# EAGLE schematic v2 (EAGLE 9.6.2)
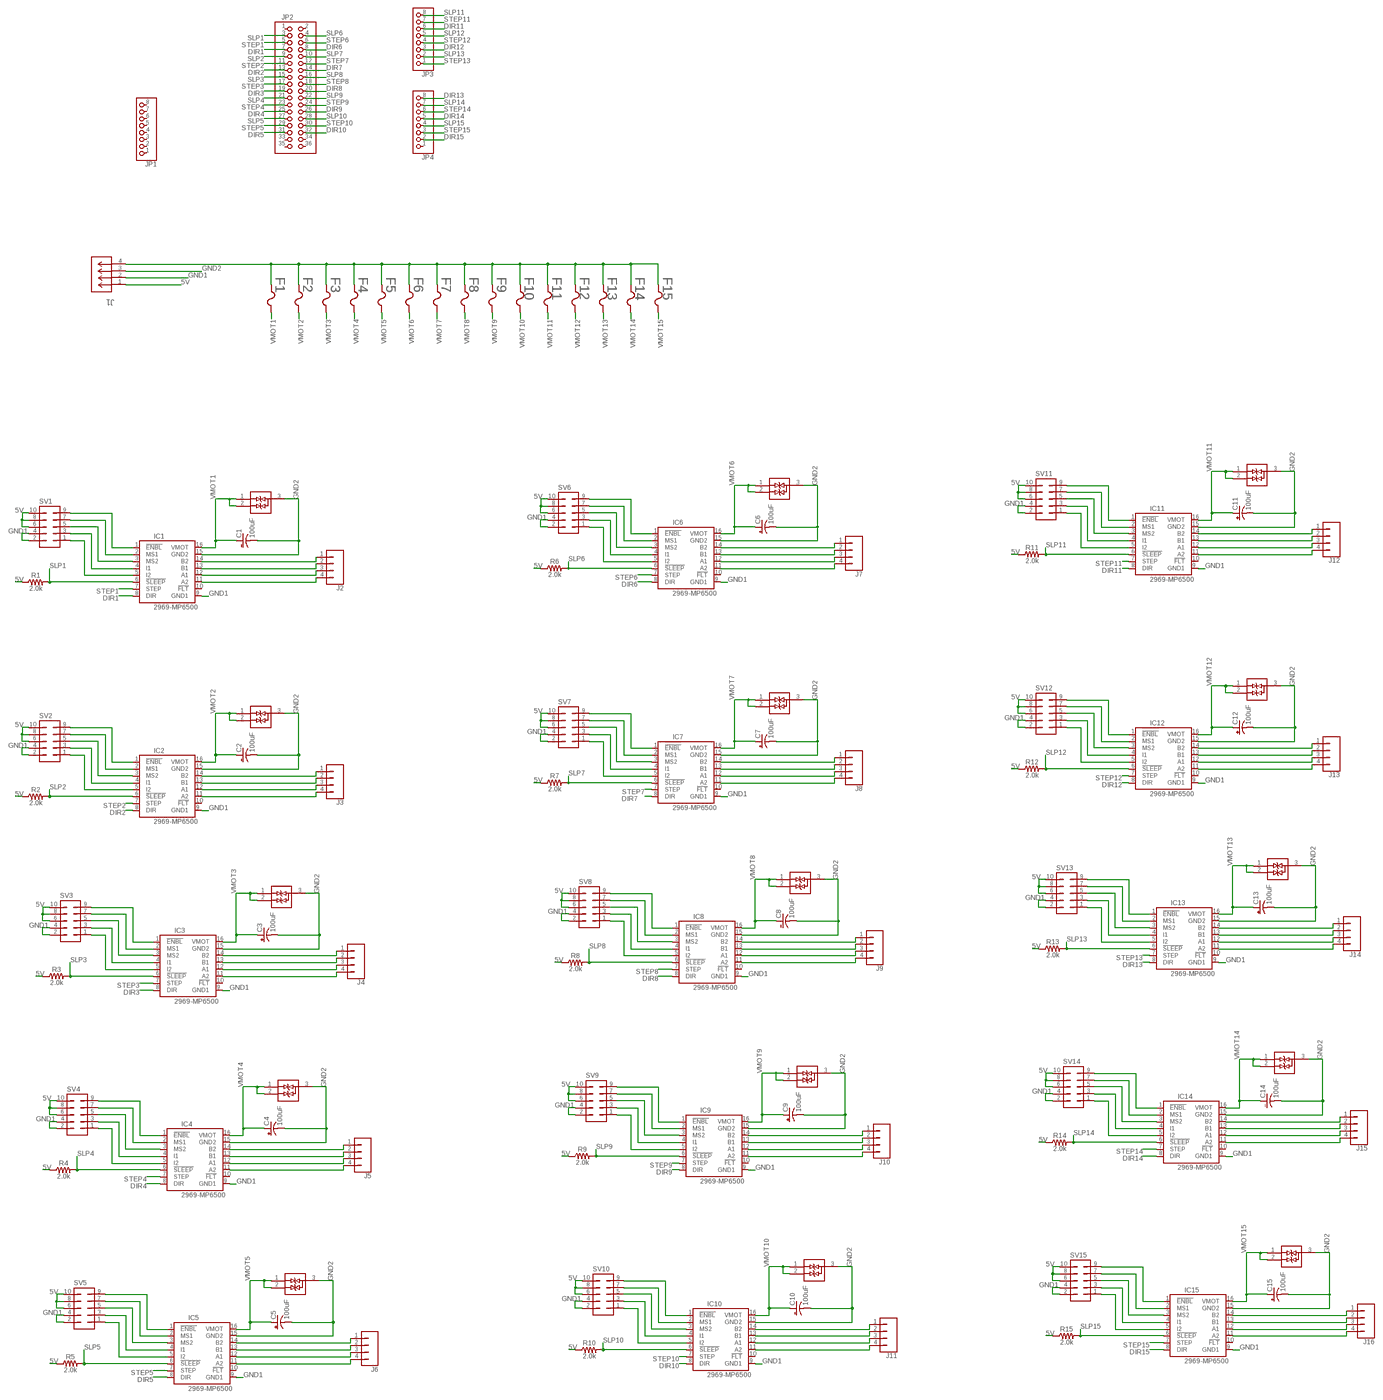
[diagram p0: schematic, sheet 1, overview]
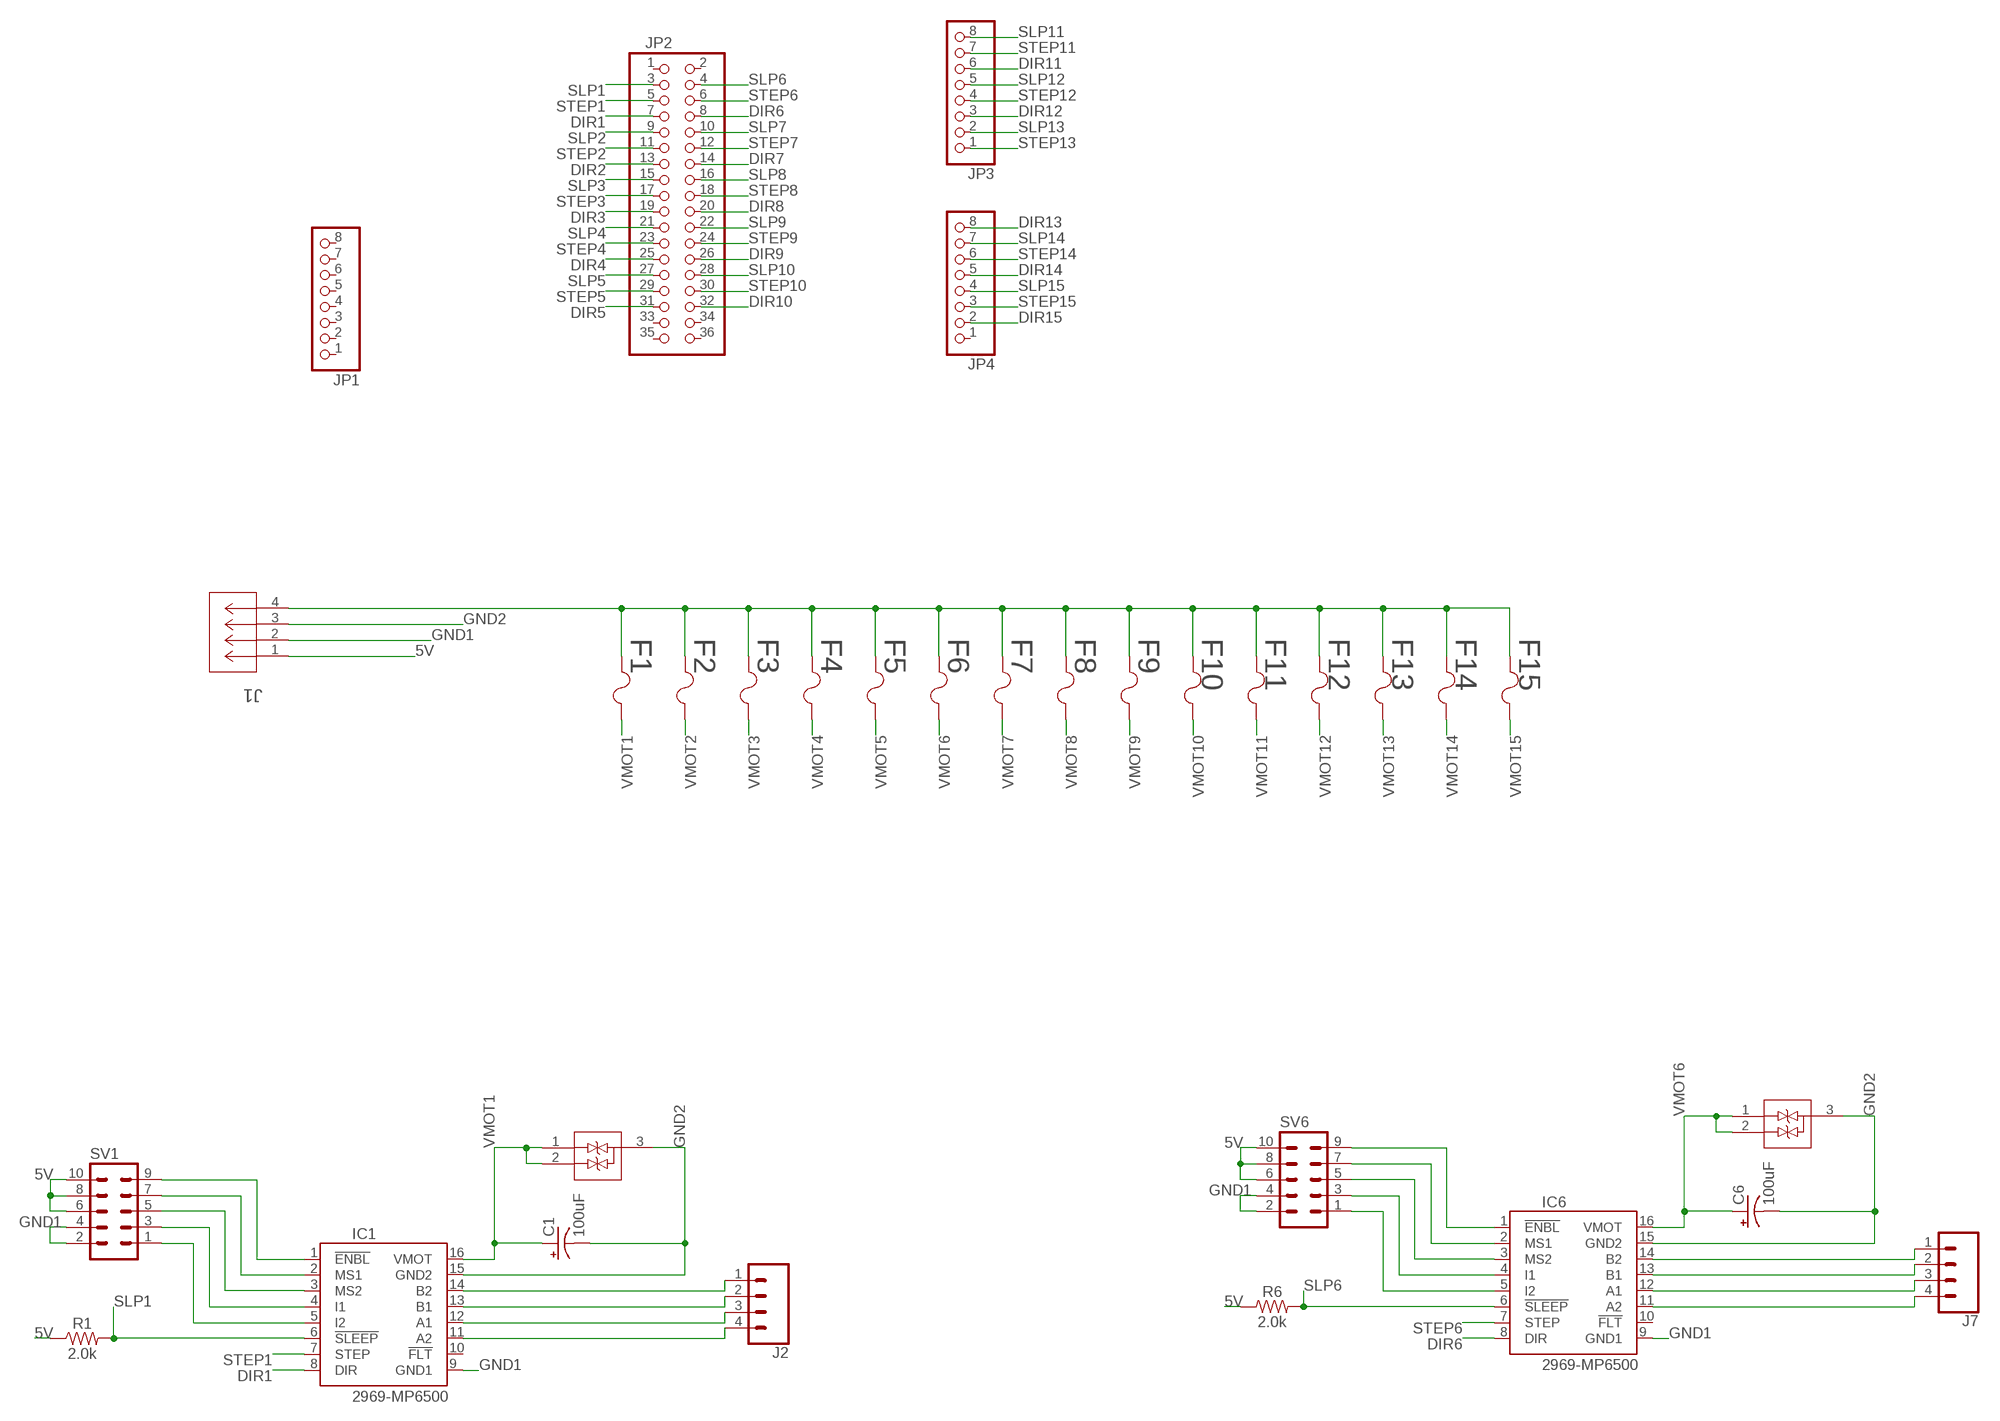
[diagram p1: schematic, sheet 1, part 1 of 4]
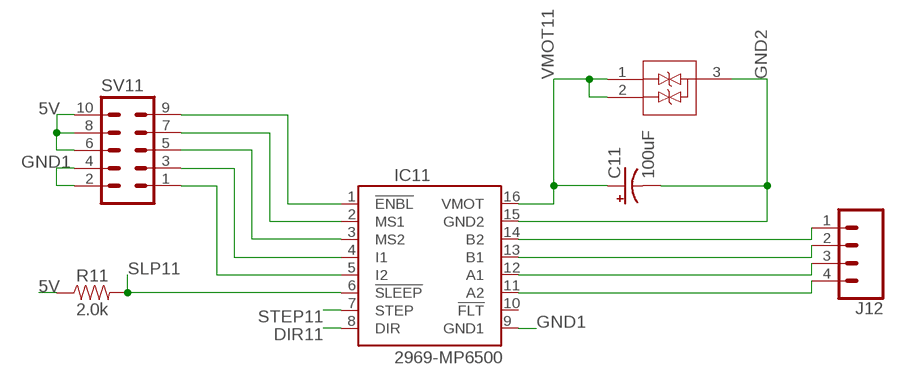
[diagram p2: schematic, sheet 1, part 2 of 4]
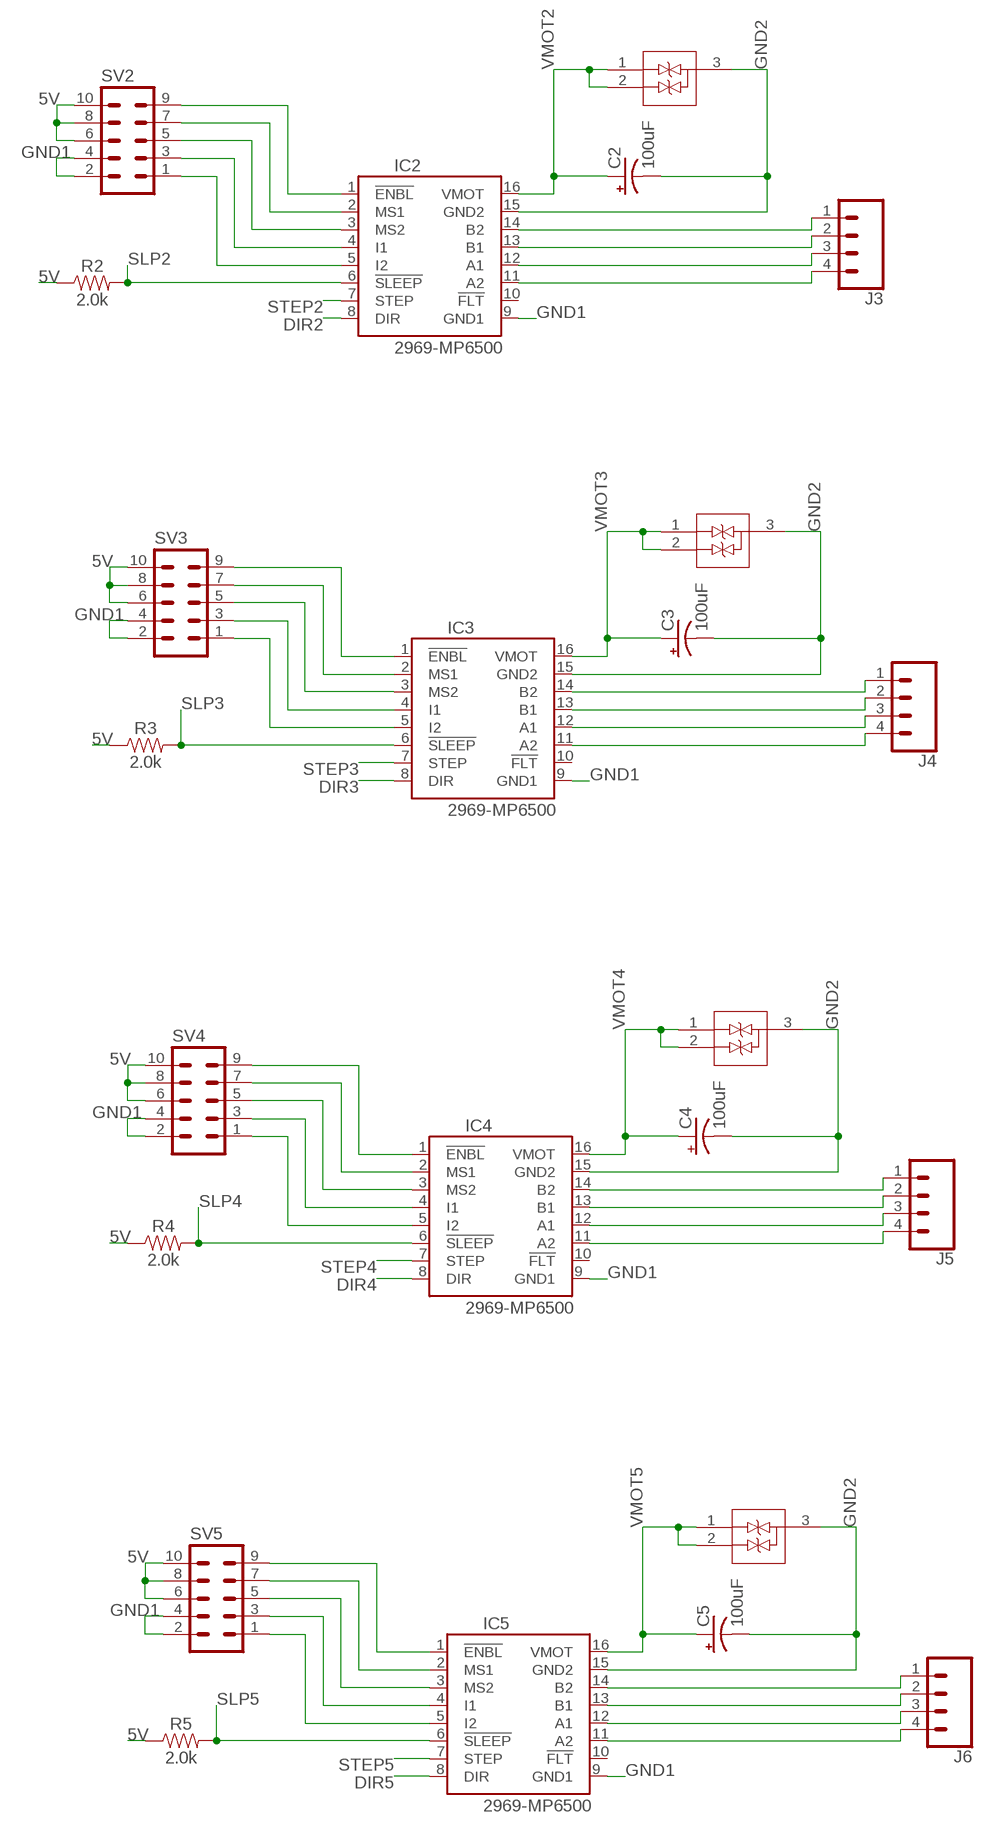
[diagram p3: schematic, sheet 1, part 3 of 4]
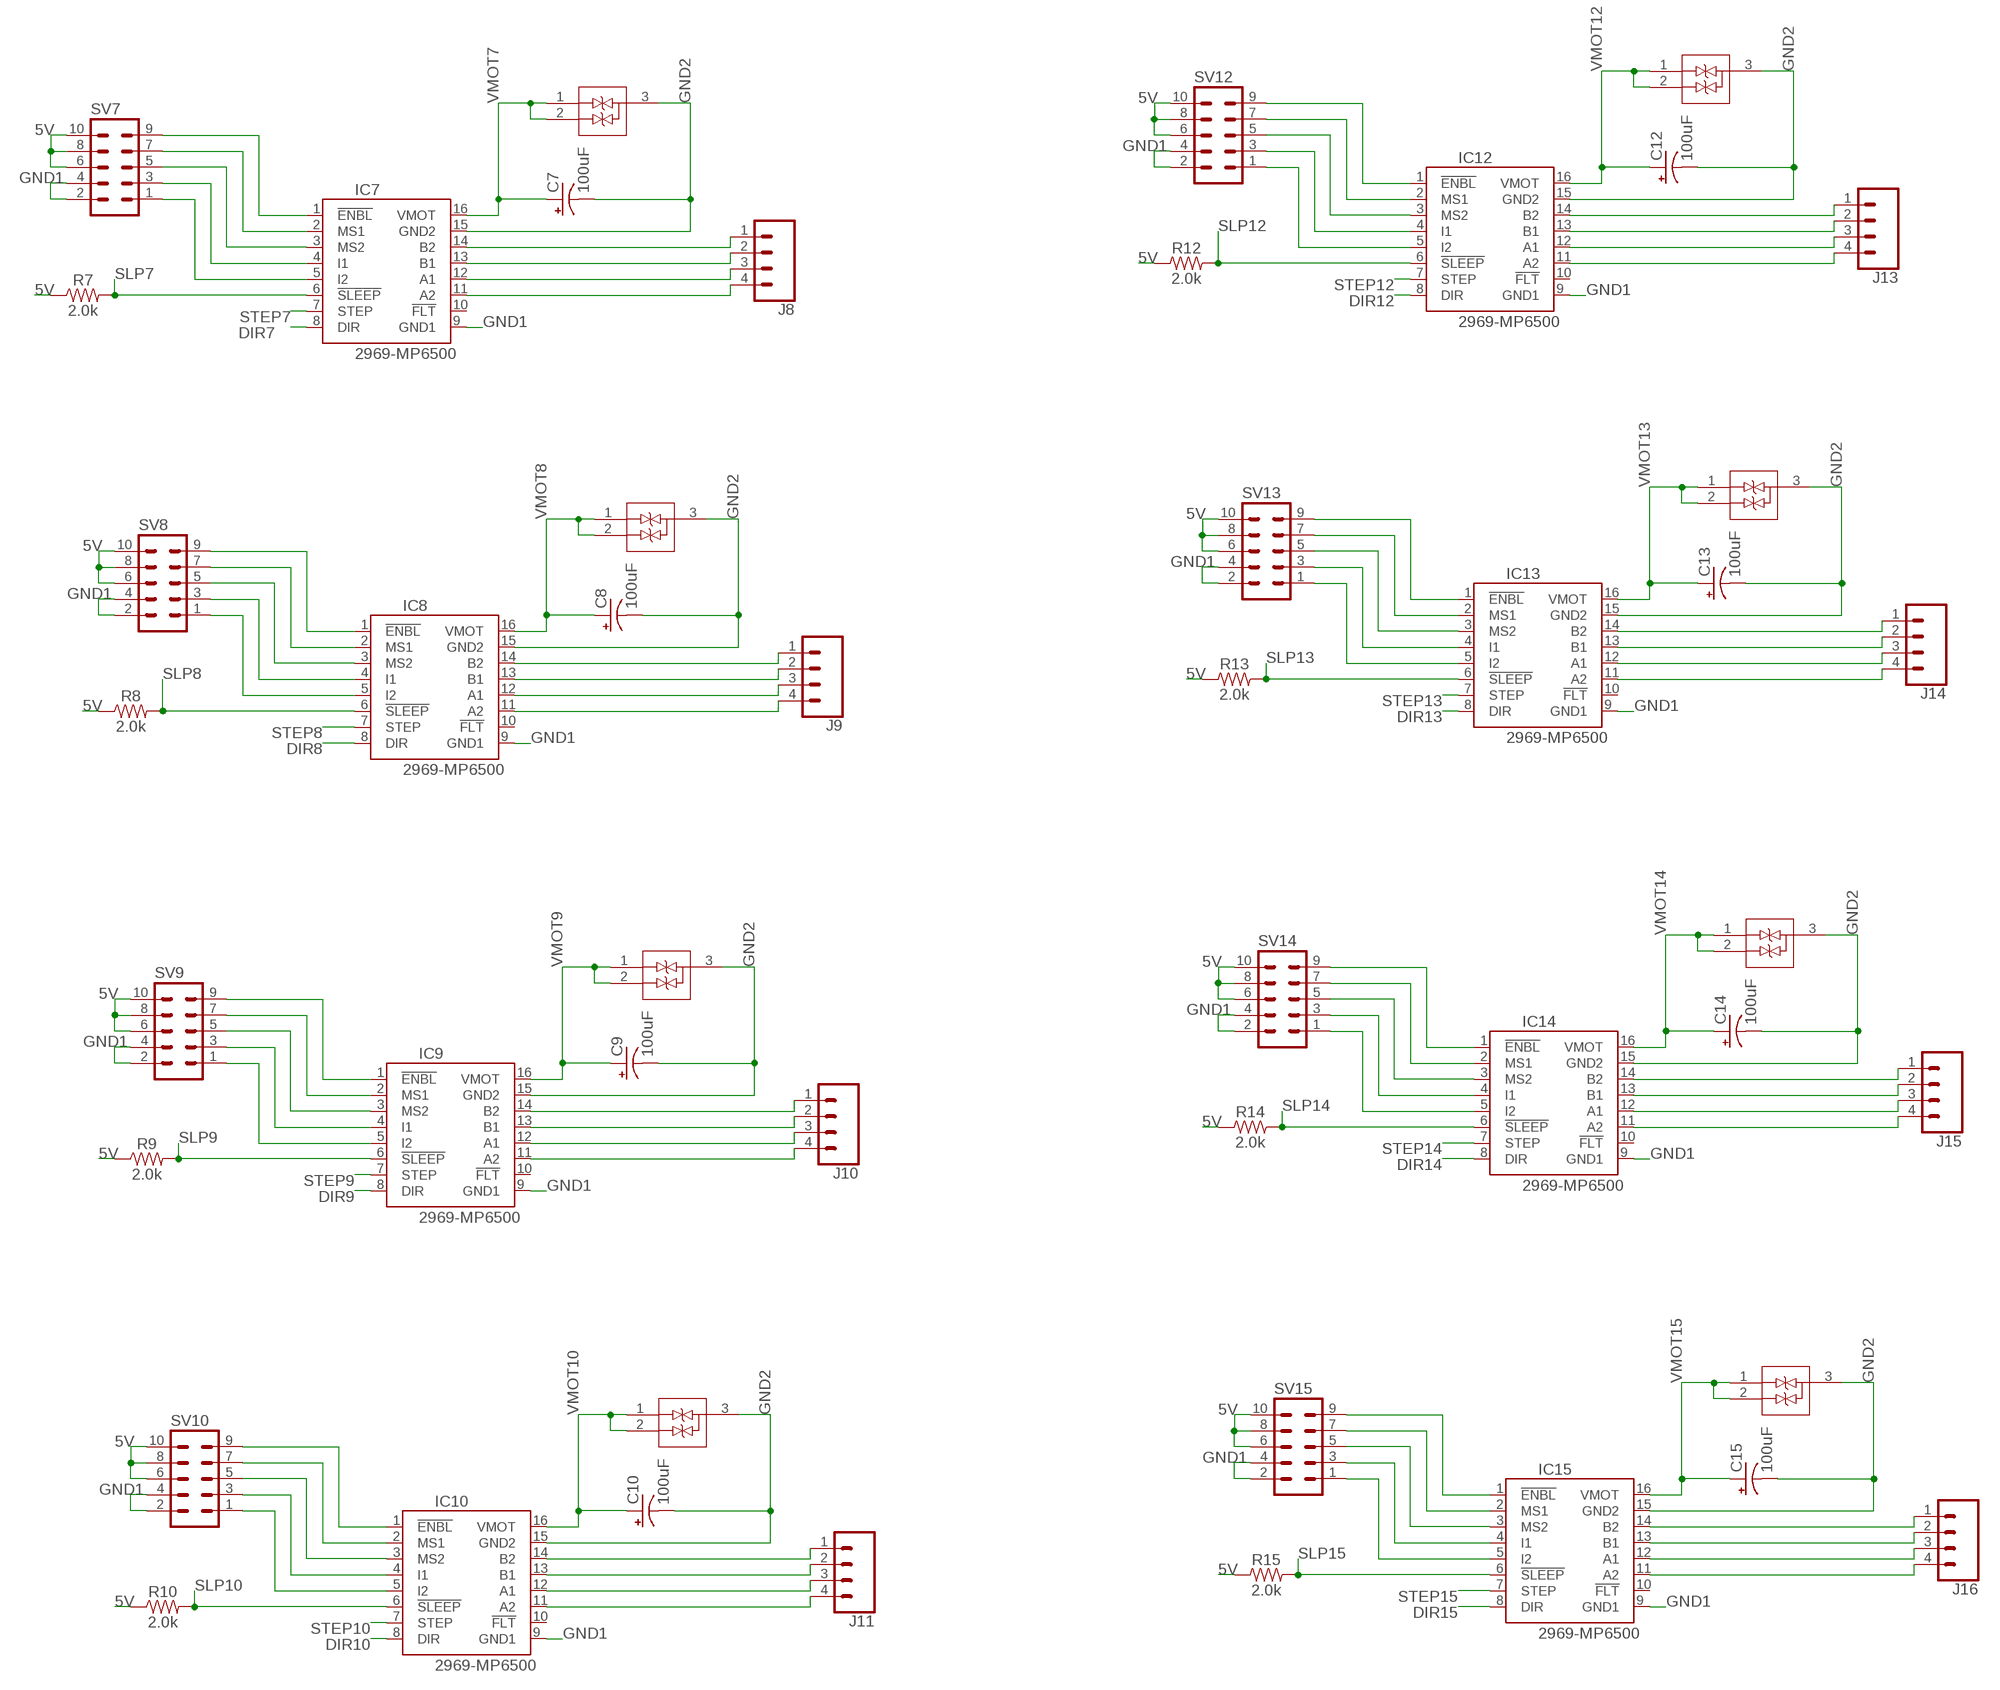
[diagram p4: schematic, sheet 1, part 4 of 4]

## Parts
C1  100uF  100UF-POLAR-8X10.5-50V  [8X10.5]
C2  100uF  100UF-POLAR-8X10.5-50V  [8X10.5]
C3  100uF  100UF-POLAR-8X10.5-50V  [8X10.5]
C4  100uF  100UF-POLAR-8X10.5-50V  [8X10.5]
C5  100uF  100UF-POLAR-8X10.5-50V  [8X10.5]
C6  100uF  100UF-POLAR-8X10.5-50V  [8X10.5]
C7  100uF  100UF-POLAR-8X10.5-50V  [8X10.5]
C8  100uF  100UF-POLAR-8X10.5-50V  [8X10.5]
C9  100uF  100UF-POLAR-8X10.5-50V  [8X10.5]
C10  100uF  100UF-POLAR-8X10.5-50V  [8X10.5]
C11  100uF  100UF-POLAR-8X10.5-50V  [8X10.5]
C12  100uF  100UF-POLAR-8X10.5-50V  [8X10.5]
C13  100uF  100UF-POLAR-8X10.5-50V  [8X10.5]
C14  100uF  100UF-POLAR-8X10.5-50V  [8X10.5]
C15  100uF  100UF-POLAR-8X10.5-50V  [8X10.5]
CR1  PESD2CAN24DBZRQ1  [SOT-23_DBZ_TEX]
CR2  PESD2CAN24DBZRQ1  [SOT-23_DBZ_TEX]
CR3  PESD2CAN24DBZRQ1  [SOT-23_DBZ_TEX]
CR4  PESD2CAN24DBZRQ1  [SOT-23_DBZ_TEX]
CR5  PESD2CAN24DBZRQ1  [SOT-23_DBZ_TEX]
CR6  PESD2CAN24DBZRQ1  [SOT-23_DBZ_TEX]
CR7  PESD2CAN24DBZRQ1  [SOT-23_DBZ_TEX]
CR8  PESD2CAN24DBZRQ1  [SOT-23_DBZ_TEX]
CR9  PESD2CAN24DBZRQ1  [SOT-23_DBZ_TEX]
CR10  PESD2CAN24DBZRQ1  [SOT-23_DBZ_TEX]
CR11  PESD2CAN24DBZRQ1  [SOT-23_DBZ_TEX]
CR12  PESD2CAN24DBZRQ1  [SOT-23_DBZ_TEX]
CR13  PESD2CAN24DBZRQ1  [SOT-23_DBZ_TEX]
CR14  PESD2CAN24DBZRQ1  [SOT-23_DBZ_TEX]
CR15  PESD2CAN24DBZRQ1  [SOT-23_DBZ_TEX]
F1  0154003.DR  [0154SERIES_LTF]
F2  0154003.DR  [0154SERIES_LTF]
F3  0154003.DR  [0154SERIES_LTF]
F4  0154003.DR  [0154SERIES_LTF]
F5  0154003.DR  [0154SERIES_LTF]
F6  0154003.DR  [0154SERIES_LTF]
F7  0154003.DR  [0154SERIES_LTF]
F8  0154003.DR  [0154SERIES_LTF]
F9  0154003.DR  [0154SERIES_LTF]
F10  0154003.DR  [0154SERIES_LTF]
F11  0154003.DR  [0154SERIES_LTF]
F12  0154003.DR  [0154SERIES_LTF]
F13  0154003.DR  [0154SERIES_LTF]
F14  0154003.DR  [0154SERIES_LTF]
F15  0154003.DR  [0154SERIES_LTF]
IC1  2969-MP6500  [MP6500]
IC2  2969-MP6500  [MP6500]
IC3  2969-MP6500  [MP6500]
IC4  2969-MP6500  [MP6500]
IC5  2969-MP6500  [MP6500]
IC6  2969-MP6500  [MP6500]
IC7  2969-MP6500  [MP6500]
IC8  2969-MP6500  [MP6500]
IC9  2969-MP6500  [MP6500]
IC10  2969-MP6500  [MP6500]
IC11  2969-MP6500  [MP6500]
IC12  2969-MP6500  [MP6500]
IC13  2969-MP6500  [MP6500]
IC14  2969-MP6500  [MP6500]
IC15  2969-MP6500  [MP6500]
J1  1888700  [CONN_1888700_PXC]
J2  CONN_04POLAR_LOCK  [MOLEX-1X4_LOCK]
J3  CONN_04POLAR_LOCK  [MOLEX-1X4_LOCK]
J4  CONN_04POLAR_LOCK  [MOLEX-1X4_LOCK]
J5  CONN_04POLAR_LOCK  [MOLEX-1X4_LOCK]
J6  CONN_04POLAR_LOCK  [MOLEX-1X4_LOCK]
J7  CONN_04POLAR_LOCK  [MOLEX-1X4_LOCK]
J8  CONN_04POLAR_LOCK  [MOLEX-1X4_LOCK]
J9  CONN_04POLAR_LOCK  [MOLEX-1X4_LOCK]
J10  CONN_04POLAR_LOCK  [MOLEX-1X4_LOCK]
J11  CONN_04POLAR_LOCK  [MOLEX-1X4_LOCK]
J12  CONN_04POLAR_LOCK  [MOLEX-1X4_LOCK]
J13  CONN_04POLAR_LOCK  [MOLEX-1X4_LOCK]
J14  CONN_04POLAR_LOCK  [MOLEX-1X4_LOCK]
J15  CONN_04POLAR_LOCK  [MOLEX-1X4_LOCK]
J16  CONN_04POLAR_LOCK  [MOLEX-1X4_LOCK]
JP1  PINHD-1X8  [1X08]
JP2  PINHD-2X18  [2X18]
JP3  PINHD-1X8  [1X08]
JP4  PINHD-1X8  [1X08]
R1  2.0k  2.0KOHM-0603-1/10W-5%  [0603]
R2  2.0k  2.0KOHM-0603-1/10W-5%  [0603]
R3  2.0k  2.0KOHM-0603-1/10W-5%  [0603]
R4  2.0k  2.0KOHM-0603-1/10W-5%  [0603]
R5  2.0k  2.0KOHM-0603-1/10W-5%  [0603]
R6  2.0k  2.0KOHM-0603-1/10W-5%  [0603]
R7  2.0k  2.0KOHM-0603-1/10W-5%  [0603]
R8  2.0k  2.0KOHM-0603-1/10W-5%  [0603]
R9  2.0k  2.0KOHM-0603-1/10W-5%  [0603]
R10  2.0k  2.0KOHM-0603-1/10W-5%  [0603]
R11  2.0k  2.0KOHM-0603-1/10W-5%  [0603]
R12  2.0k  2.0KOHM-0603-1/10W-5%  [0603]
R13  2.0k  2.0KOHM-0603-1/10W-5%  [0603]
R14  2.0k  2.0KOHM-0603-1/10W-5%  [0603]
R15  2.0k  2.0KOHM-0603-1/10W-5%  [0603]
SV1  MA05-2  [MA05-2]
SV2  MA05-2  [MA05-2]
SV3  MA05-2  [MA05-2]
SV4  MA05-2  [MA05-2]
SV5  MA05-2  [MA05-2]
SV6  MA05-2  [MA05-2]
SV7  MA05-2  [MA05-2]
SV8  MA05-2  [MA05-2]
SV9  MA05-2  [MA05-2]
SV10  MA05-2  [MA05-2]
SV11  MA05-2  [MA05-2]
SV12  MA05-2  [MA05-2]
SV13  MA05-2  [MA05-2]
SV14  MA05-2  [MA05-2]
SV15  MA05-2  [MA05-2]

## Nets
5V: J1.1 R1.1 R2.1 R3.1 R4.1 R5.1 R6.1 R7.1 R8.1 R9.1 R10.1 R11.1 R12.1 R13.1 R14.1 R15.1 SV1.6 SV1.8 SV1.10 SV2.6 SV2.8 SV2.10 SV3.6 SV3.8 SV3.10 SV4.6 SV4.8 SV4.10 SV5.6 SV5.8 SV5.10 SV6.6 SV6.8 SV6.10 SV7.6 SV7.8 SV7.10 SV8.6 SV8.8 SV8.10 SV9.6 SV9.8 SV9.10 SV10.6 SV10.8 SV10.10 SV11.6 SV11.8 SV11.10 SV12.6 SV12.8 SV12.10 SV13.6 SV13.8 SV13.10 SV14.6 SV14.8 SV14.10 SV15.6 SV15.8 SV15.10
DIR1: IC1.8(DIR) JP2.7
DIR2: IC2.8(DIR) JP2.13
DIR3: IC3.8(DIR) JP2.19
DIR4: IC4.8(DIR) JP2.25
DIR5: IC5.8(DIR) JP2.31
DIR6: IC6.8(DIR) JP2.8
DIR7: IC7.8(DIR) JP2.14
DIR8: IC8.8(DIR) JP2.20
DIR9: IC9.8(DIR) JP2.26
DIR10: IC10.8(DIR) JP2.32
DIR11: IC11.8(DIR) JP3.6
DIR12: IC12.8(DIR) JP3.3
DIR13: IC13.8(DIR) JP4.8
DIR14: IC14.8(DIR) JP4.5
DIR15: IC15.8(DIR) JP4.2
GND1: IC1.9(GND1) IC2.9(GND1) IC3.9(GND1) IC4.9(GND1) IC5.9(GND1) IC6.9(GND1) IC7.9(GND1) IC8.9(GND1) IC9.9(GND1) IC10.9(GND1) IC11.9(GND1) IC12.9(GND1) IC13.9(GND1) IC14.9(GND1) IC15.9(GND1) J1.2 SV1.2 SV1.4 SV2.2 SV2.4 SV3.2 SV3.4 SV4.2 SV4.4 SV5.2 SV5.4 SV6.2 SV6.4 SV7.2 SV7.4 SV8.2 SV8.4 SV9.2 SV9.4 SV10.2 SV10.4 SV11.2 SV11.4 SV12.2 SV12.4 SV13.2 SV13.4 SV14.2 SV14.4 SV15.2 SV15.4
GND2 [PreFuse]: C1.- C2.- C3.- C4.- C5.- C6.- C7.- C8.- C9.- C10.- C11.- C12.- C13.- C14.- C15.- CR1.3 CR2.3 CR3.3 CR4.3 CR5.3 CR6.3 CR7.3 CR8.3 CR9.3 CR10.3 CR11.3 CR12.3 CR13.3 CR14.3 CR15.3 IC1.15(GND2) IC2.15(GND2) IC3.15(GND2) IC4.15(GND2) IC5.15(GND2) IC6.15(GND2) IC7.15(GND2) IC8.15(GND2) IC9.15(GND2) IC10.15(GND2) IC11.15(GND2) IC12.15(GND2) IC13.15(GND2) IC14.15(GND2) IC15.15(GND2) J1.3
N$2 [Motor]: IC1.14(B2) J2.1
N$3 [Motor]: IC1.13(B1) J2.2
N$5 [Motor]: IC1.12(A1) J2.3
N$6 [Motor]: IC1.11(A2) J2.4
N$108: IC1.5(I2) SV1.1
N$109: IC1.4(I1) SV1.3
N$110: IC1.3(MS2) SV1.5
N$111: IC1.2(MS1) SV1.7
N$112: IC1.1(!ENBL) SV1.9
N$182 [PreFuse]: F1.1 F2.1 F3.1 F4.1 F5.1 F6.1 F7.1 F8.1 F9.1 F10.1 F11.1 F12.1 F13.1 F14.1 F15.1 J1.4
N$183: IC2.5(I2) SV2.1
N$184: IC3.5(I2) SV3.1
N$185: IC3.4(I1) SV3.3
N$186: IC3.3(MS2) SV3.5
N$187: IC3.2(MS1) SV3.7
N$188: IC3.1(!ENBL) SV3.9
N$189 [Motor]: IC3.14(B2) J4.1
N$190 [Motor]: IC3.13(B1) J4.2
N$191 [Motor]: IC3.12(A1) J4.3
N$192 [Motor]: IC3.11(A2) J4.4
N$193: IC4.5(I2) SV4.1
N$194: IC4.4(I1) SV4.3
N$195: IC4.3(MS2) SV4.5
N$196: IC4.2(MS1) SV4.7
N$197: IC4.1(!ENBL) SV4.9
N$198: IC2.4(I1) SV2.3
N$199: IC2.3(MS2) SV2.5
N$200: IC2.2(MS1) SV2.7
N$201: IC2.1(!ENBL) SV2.9
N$202 [Motor]: IC2.14(B2) J3.1
N$203 [Motor]: IC2.13(B1) J3.2
N$204 [Motor]: IC2.12(A1) J3.3
N$205 [Motor]: IC2.11(A2) J3.4
N$206 [Motor]: IC4.14(B2) J5.1
N$207 [Motor]: IC4.13(B1) J5.2
N$208 [Motor]: IC4.12(A1) J5.3
N$209 [Motor]: IC4.11(A2) J5.4
N$210: IC6.5(I2) SV6.1
N$211: IC6.4(I1) SV6.3
N$212: IC6.3(MS2) SV6.5
N$213: IC6.2(MS1) SV6.7
N$214: IC6.1(!ENBL) SV6.9
N$215 [Motor]: IC6.14(B2) J7.1
N$216 [Motor]: IC6.13(B1) J7.2
N$217 [Motor]: IC6.12(A1) J7.3
N$218 [Motor]: IC6.11(A2) J7.4
N$219: IC5.5(I2) SV5.1
N$220: IC5.4(I1) SV5.3
N$221: IC5.3(MS2) SV5.5
N$222: IC5.2(MS1) SV5.7
N$223: IC5.1(!ENBL) SV5.9
N$224 [Motor]: IC5.14(B2) J6.1
N$225 [Motor]: IC5.13(B1) J6.2
N$226 [Motor]: IC5.12(A1) J6.3
N$227 [Motor]: IC5.11(A2) J6.4
N$228: IC7.5(I2) SV7.1
N$229: IC7.4(I1) SV7.3
N$230: IC7.3(MS2) SV7.5
N$231: IC7.2(MS1) SV7.7
N$232: IC7.1(!ENBL) SV7.9
N$233 [Motor]: IC7.14(B2) J8.1
N$234 [Motor]: IC7.13(B1) J8.2
N$235 [Motor]: IC7.12(A1) J8.3
N$236 [Motor]: IC7.11(A2) J8.4
N$237: IC8.5(I2) SV8.1
N$238: IC8.4(I1) SV8.3
N$239: IC8.3(MS2) SV8.5
N$240: IC8.2(MS1) SV8.7
N$241: IC8.1(!ENBL) SV8.9
N$242 [Motor]: IC8.14(B2) J9.1
N$243 [Motor]: IC8.13(B1) J9.2
N$244 [Motor]: IC8.12(A1) J9.3
N$245 [Motor]: IC8.11(A2) J9.4
N$246: IC9.5(I2) SV9.1
N$247: IC9.4(I1) SV9.3
N$248: IC9.3(MS2) SV9.5
N$249: IC9.2(MS1) SV9.7
N$250: IC9.1(!ENBL) SV9.9
N$251 [Motor]: IC9.14(B2) J10.1
N$252 [Motor]: IC9.13(B1) J10.2
N$253 [Motor]: IC9.12(A1) J10.3
N$254 [Motor]: IC9.11(A2) J10.4
N$255: IC10.5(I2) SV10.1
N$256: IC10.4(I1) SV10.3
N$257: IC10.3(MS2) SV10.5
N$258: IC10.2(MS1) SV10.7
N$259: IC10.1(!ENBL) SV10.9
N$260 [Motor]: IC10.14(B2) J11.1
N$261 [Motor]: IC10.13(B1) J11.2
N$262 [Motor]: IC10.12(A1) J11.3
N$263 [Motor]: IC10.11(A2) J11.4
N$264: IC11.5(I2) SV11.1
N$265: IC11.4(I1) SV11.3
N$266: IC11.3(MS2) SV11.5
N$267: IC11.2(MS1) SV11.7
N$268: IC11.1(!ENBL) SV11.9
N$269 [Motor]: IC11.14(B2) J12.1
N$270 [Motor]: IC11.13(B1) J12.2
N$271 [Motor]: IC11.12(A1) J12.3
N$272 [Motor]: IC11.11(A2) J12.4
N$273: IC12.5(I2) SV12.1
N$274: IC12.4(I1) SV12.3
N$275: IC12.3(MS2) SV12.5
N$276: IC12.2(MS1) SV12.7
N$277: IC12.1(!ENBL) SV12.9
N$278 [Motor]: IC12.14(B2) J13.1
N$279 [Motor]: IC12.13(B1) J13.2
N$280 [Motor]: IC12.12(A1) J13.3
N$281 [Motor]: IC12.11(A2) J13.4
N$282: IC13.5(I2) SV13.1
N$283: IC13.4(I1) SV13.3
N$284: IC13.3(MS2) SV13.5
N$285: IC13.2(MS1) SV13.7
N$286: IC13.1(!ENBL) SV13.9
N$287 [Motor]: IC13.14(B2) J14.1
N$288 [Motor]: IC13.13(B1) J14.2
N$289 [Motor]: IC13.12(A1) J14.3
N$290 [Motor]: IC13.11(A2) J14.4
N$291: IC14.5(I2) SV14.1
N$292: IC14.4(I1) SV14.3
N$293: IC14.3(MS2) SV14.5
N$294: IC14.2(MS1) SV14.7
N$295: IC14.1(!ENBL) SV14.9
N$296 [Motor]: IC14.14(B2) J15.1
N$297 [Motor]: IC14.13(B1) J15.2
N$298 [Motor]: IC14.12(A1) J15.3
N$299 [Motor]: IC14.11(A2) J15.4
N$300: IC15.5(I2) SV15.1
N$301: IC15.4(I1) SV15.3
N$302: IC15.3(MS2) SV15.5
N$303: IC15.2(MS1) SV15.7
N$304: IC15.1(!ENBL) SV15.9
N$305 [Motor]: IC15.14(B2) J16.1
N$306 [Motor]: IC15.13(B1) J16.2
N$307 [Motor]: IC15.12(A1) J16.3
N$308 [Motor]: IC15.11(A2) J16.4
SLP1: IC1.6(!SLEEP) JP2.3 R1.2
SLP2: IC2.6(!SLEEP) JP2.9 R2.2
SLP3: IC3.6(!SLEEP) JP2.15 R3.2
SLP4: IC4.6(!SLEEP) JP2.21 R4.2
SLP5: IC5.6(!SLEEP) JP2.27 R5.2
SLP6: IC6.6(!SLEEP) JP2.4 R6.2
SLP7: IC7.6(!SLEEP) JP2.10 R7.2
SLP8: IC8.6(!SLEEP) JP2.16 R8.2
SLP9: IC9.6(!SLEEP) JP2.22 R9.2
SLP10: IC10.6(!SLEEP) JP2.28 R10.2
SLP11: IC11.6(!SLEEP) JP3.8 R11.2
SLP12: IC12.6(!SLEEP) JP3.5 R12.2
SLP13: IC13.6(!SLEEP) JP3.2 R13.2
SLP14: IC14.6(!SLEEP) JP4.7 R14.2
SLP15: IC15.6(!SLEEP) JP4.4 R15.2
STEP1: IC1.7(STEP) JP2.5
STEP2: IC2.7(STEP) JP2.11
STEP3: IC3.7(STEP) JP2.17
STEP4: IC4.7(STEP) JP2.23
STEP5: IC5.7(STEP) JP2.29
STEP6: IC6.7(STEP) JP2.6
STEP7: IC7.7(STEP) JP2.12
STEP8: IC8.7(STEP) JP2.18
STEP9: IC9.7(STEP) JP2.24
STEP10: IC10.7(STEP) JP2.30
STEP11: IC11.7(STEP) JP3.7
STEP12: IC12.7(STEP) JP3.4
STEP13: IC13.7(STEP) JP3.1
STEP14: IC14.7(STEP) JP4.6
STEP15: IC15.7(STEP) JP4.3
VMOT1 [PreFuse]: C1.+ CR1.1 CR1.2 F1.2 IC1.16(VMOT)
VMOT2 [PreFuse]: C2.+ CR2.1 CR2.2 F2.2 IC2.16(VMOT)
VMOT3 [PreFuse]: C3.+ CR3.1 CR3.2 F3.2 IC3.16(VMOT)
VMOT4 [PreFuse]: C4.+ CR4.1 CR4.2 F4.2 IC4.16(VMOT)
VMOT5 [PreFuse]: C5.+ CR5.1 CR5.2 F5.2 IC5.16(VMOT)
VMOT6 [PreFuse]: C6.+ CR6.1 CR6.2 F6.2 IC6.16(VMOT)
VMOT7 [PreFuse]: C7.+ CR7.1 CR7.2 F7.2 IC7.16(VMOT)
VMOT8 [PreFuse]: C8.+ CR8.1 CR8.2 F8.2 IC8.16(VMOT)
VMOT9 [PreFuse]: C9.+ CR9.1 CR9.2 F9.2 IC9.16(VMOT)
VMOT10 [PreFuse]: C10.+ CR10.1 CR10.2 F10.2 IC10.16(VMOT)
VMOT11 [PreFuse]: C11.+ CR11.1 CR11.2 F11.2 IC11.16(VMOT)
VMOT12 [PreFuse]: C12.+ CR12.1 CR12.2 F12.2 IC12.16(VMOT)
VMOT13 [PreFuse]: C13.+ CR13.1 CR13.2 F13.2 IC13.16(VMOT)
VMOT14 [PreFuse]: C14.+ CR14.1 CR14.2 F14.2 IC14.16(VMOT)
VMOT15 [PreFuse]: C15.+ CR15.1 CR15.2 F15.2 IC15.16(VMOT)
Unconnected: IC1.10(!FLT) IC2.10(!FLT) IC3.10(!FLT) IC4.10(!FLT) IC5.10(!FLT) IC6.10(!FLT) IC7.10(!FLT) IC8.10(!FLT) IC9.10(!FLT) IC10.10(!FLT) IC11.10(!FLT) IC12.10(!FLT) IC13.10(!FLT) IC14.10(!FLT) IC15.10(!FLT) JP1.1 JP1.2 JP1.3 JP1.4 JP1.5 JP1.6 JP1.7 JP1.8 JP2.1 JP2.2 JP2.33 JP2.34 JP2.35 JP2.36 JP4.1

## Library data of the parts
C1-C15 = SparkFun-Capacitors:100UF-POLAR: 100µF polarized capacitors A capacitor is a passive two-terminal electrical component used to store electrical energy temporarily in an electric field.; PROD_ID: CAP-15455
CR1-CR15 = TVS_Diode:PESD2CAN24DBZRQ1; COPYRIGHT: Copyright (C) 2023 Ultra Librarian. All rights reserved.; MANUFACTURER_PART_NUMBER: PESD2CAN24DBZRQ1; MFR_NAME: Texas Instruments
F1-F15 = Fuse:0154003.DR: FUSE BOARD MNT 3A 125VAC/VDC SMD; COPYRIGHT: Copyright (C) 2023 Ultra Librarian. All rights reserved.; MANUFACTURER_PART_NUMBER: 0154003.DR; MFR_NAME: Littelfuse Inc
IC1-IC15 = pololu-stepper-driver:2969-MP6500: MP6500 Stepper Motor Driver Carrier; Digital Current Control (Header Pins Soldered) #2969 MP6500 Stepper Motor Driver Carrier; Digital Current Control (Header Pins Soldered) <https://www.pololu.com/product/2969> in Japan, Suzaku Lab. Ltd. <https://suzakugiken.jp/> #2969 MP6500ステッピングモータドライバボード デジタル式電流制御 (ヘッダーピン実装済み) <https://szc.jp/po2969>
J1 = PheonixContactTerm:1888700; COPYRIGHT: Copyright (C) 2023 Ultra Librarian. All rights reserved.; DIGIKEY_PART_NUMBER_1: 277-6294-ND; MANUFACTURER_PART_NUMBER: 1888700; MFR_NAME: Phoenix Contact
J2-J16 = SparkFun-Connectors:CONN_04: Multi connection point. Often used as Generic Header-pin footprint for 0.1 inch spaced/style header connections On any of the 0.1 inch spaced packages, you can populate with these: Break Away Headers - Straight <https://www.sparkfun.com/products/116> (PRT-00116) Break Away Male Headers - Right Angle <https://www.sparkfun.com/products/553> (PRT-00553) Female Headers <https://www.sparkfun.com/products/115> (PRT-00115) Break Away Headers - Machine Pin <https://www.sparkfun.com/products/117> (PRT-00117) Break Away Female Headers - Swiss Machine Pin <https://www.sparkfun.com/products/743> (PRT-00743) For SCREWTERMINALS and SPRING TERMINALS visit here: Screw Terimnals on SparkFun.com <https://www.sparkfun.com/search/results?term=Screw+Terminals> (5mm/3.5mm/2.54mm spacing) This device is also useful as a general connection point to wire up your design to another part of your project. Our various solder wires solder well into these plated through hole pads. Hook-Up Wire - Assortment (Stranded, 22 AWG) <https://www.sparkfun.com/products/11375> (PRT-11375) Hook-Up Wire - Assortment (Solid Core, 22 AWG) <https://www.sparkfun.com/products/11367> (PRT-11367) View the entire wire category on our website here <https://www.sparkfun.com/categories/141> Special notes: Molex polarized connector foot print use with SKU : PRT-08231 with associated crimp pins and housings. 1MM SMD Version SKU: PRT-10208; PROD_ID: CONN-08186; SF_ID: PRT-08231
JP1 JP3 JP4 = pinhead:PINHD-1X8: PIN HEADER
JP2 = pinhead:PINHD-2X18: PIN HEADER
R1-R15 = SparkFun-Resistors:2.0KOHM: 2kΩ resistor A resistor is a passive two-terminal electrical component that implements electrical resistance as a circuit element. Resistors act to reduce current flow, and, at the same time, act to lower voltage levels within circuits. - Wikipedia; PROD_ID: RES-08296
SV1-SV15 = con-lstb:MA05-2: PIN HEADER; OC_FARNELL: unknown; OC_NEWARK: unknown

## Net classes
1 Motor: width 0.699 mm, drill 0.5 mm
2 VMOT: width 0.699 mm, drill 0.5 mm
3 GND: width 0.699 mm, drill 0.5 mm
4 PreFuse: width 2.032 mm, drill 1.5 mm, clearance 0.006 mm